# Altium schematic sheet Nut-nhan.SchDoc
size A3
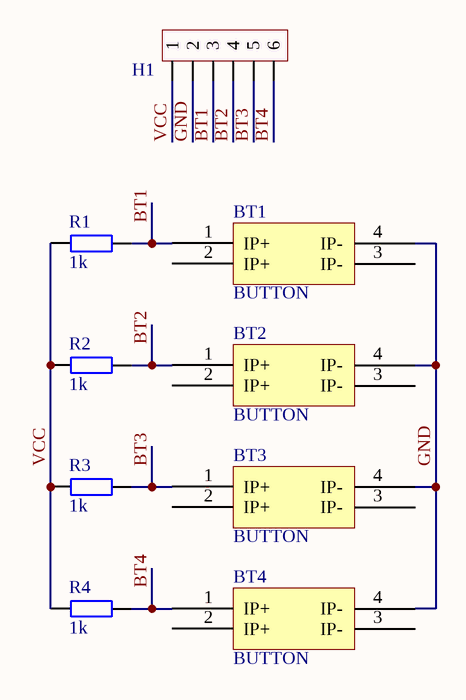
[diagram p0: Nut-nhan.SchDoc]

## Parts
BT1  BUTTON  [BUTTON4]
BT2  BUTTON  [BUTTON4]
BT3  BUTTON  [BUTTON4]
BT4  BUTTON  [BUTTON4]
H1  Header6  [HDR6]  (value not drawn)
R1  1k  [R1/4W]
R2  1k  [R1/4W]
R3  1k  [R1/4W]
R4  1k  [R1/4W]

## Nets
BT1: BT1.1(IP+) H1.3 R1.2
BT2: BT2.1(IP+) H1.4 R2.2
BT3: BT3.1(IP+) H1.5 R3.2
BT4: BT4.1(IP+) H1.6 R4.2
GND: BT1.4(IP-) BT2.4(IP-) BT3.4(IP-) BT4.4(IP-) H1.2
VCC: H1.1 R1.1 R2.1 R3.1 R4.1

Not connected (* = marked no-connect by the designer): BT1 2(IP+) 3(IP-); BT2 2(IP+) 3(IP-); BT3 2(IP+) 3(IP-); BT4 2(IP+) 3(IP-)

## Library data of the parts
BT1-BT4 = BUTTON4
H1 = Header6: Header IDC, 6 x 1 Pin Vertical 2.54mm Pitch (Non-Boxed, Male)
R1-R4 = R1/4W: Resistor 1/4W; Value: R1/4W - 1K